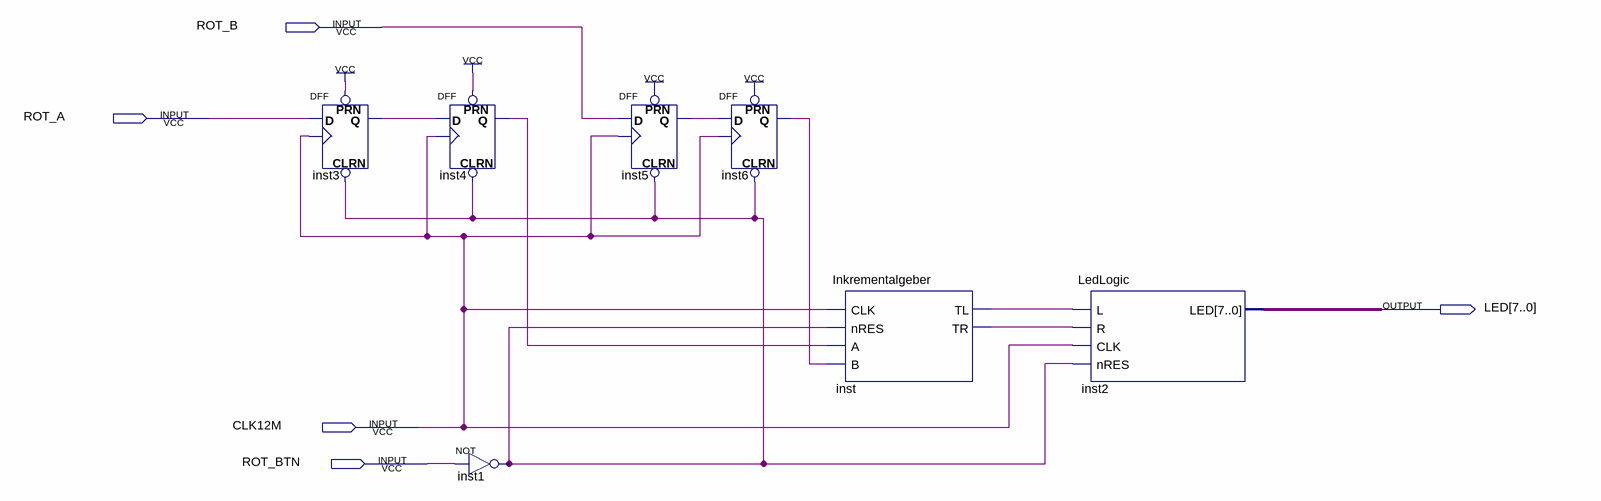
[diagram p0: schematic sheet]
// Quartus schematic RotaryLauflicht.bdf as structural Verilog: 7 symbols, 5 pins
module RotaryLauflicht (
  input  ROT_B,
  input  ROT_A,
  input  CLK12M,
  input  ROT_BTN,
  output [7:0] LED
);

  wire inst1_out, inst3_q, inst4_q, inst5_q, inst6_q, inst_tl, inst_tr;

  DFF inst3 (.CLRN(inst1_out), .CLK(CLK12M), .D(ROT_A), .PRN(1'b1), .Q(inst3_q));
  DFF inst4 (.CLRN(inst1_out), .CLK(CLK12M), .D(inst3_q), .PRN(1'b1), .Q(inst4_q));
  not inst1 (inst1_out, ROT_BTN);
  DFF inst5 (.CLRN(inst1_out), .CLK(CLK12M), .D(ROT_B), .PRN(1'b1), .Q(inst5_q));
  DFF inst6 (.CLRN(inst1_out), .CLK(CLK12M), .D(inst5_q), .PRN(1'b1), .Q(inst6_q));
  Inkrementalgeber inst (.CLK(CLK12M), .nRES(inst1_out), .A(inst4_q), .B(inst6_q), .TL(inst_tl), .TR(inst_tr));
  LedLogic inst2 (.L(inst_tl), .R(inst_tr), .CLK(CLK12M), .nRES(inst1_out), .LED(LED));
endmodule
